# Altium project 2021_PCB_Project_PowerBoard.PrjPcb
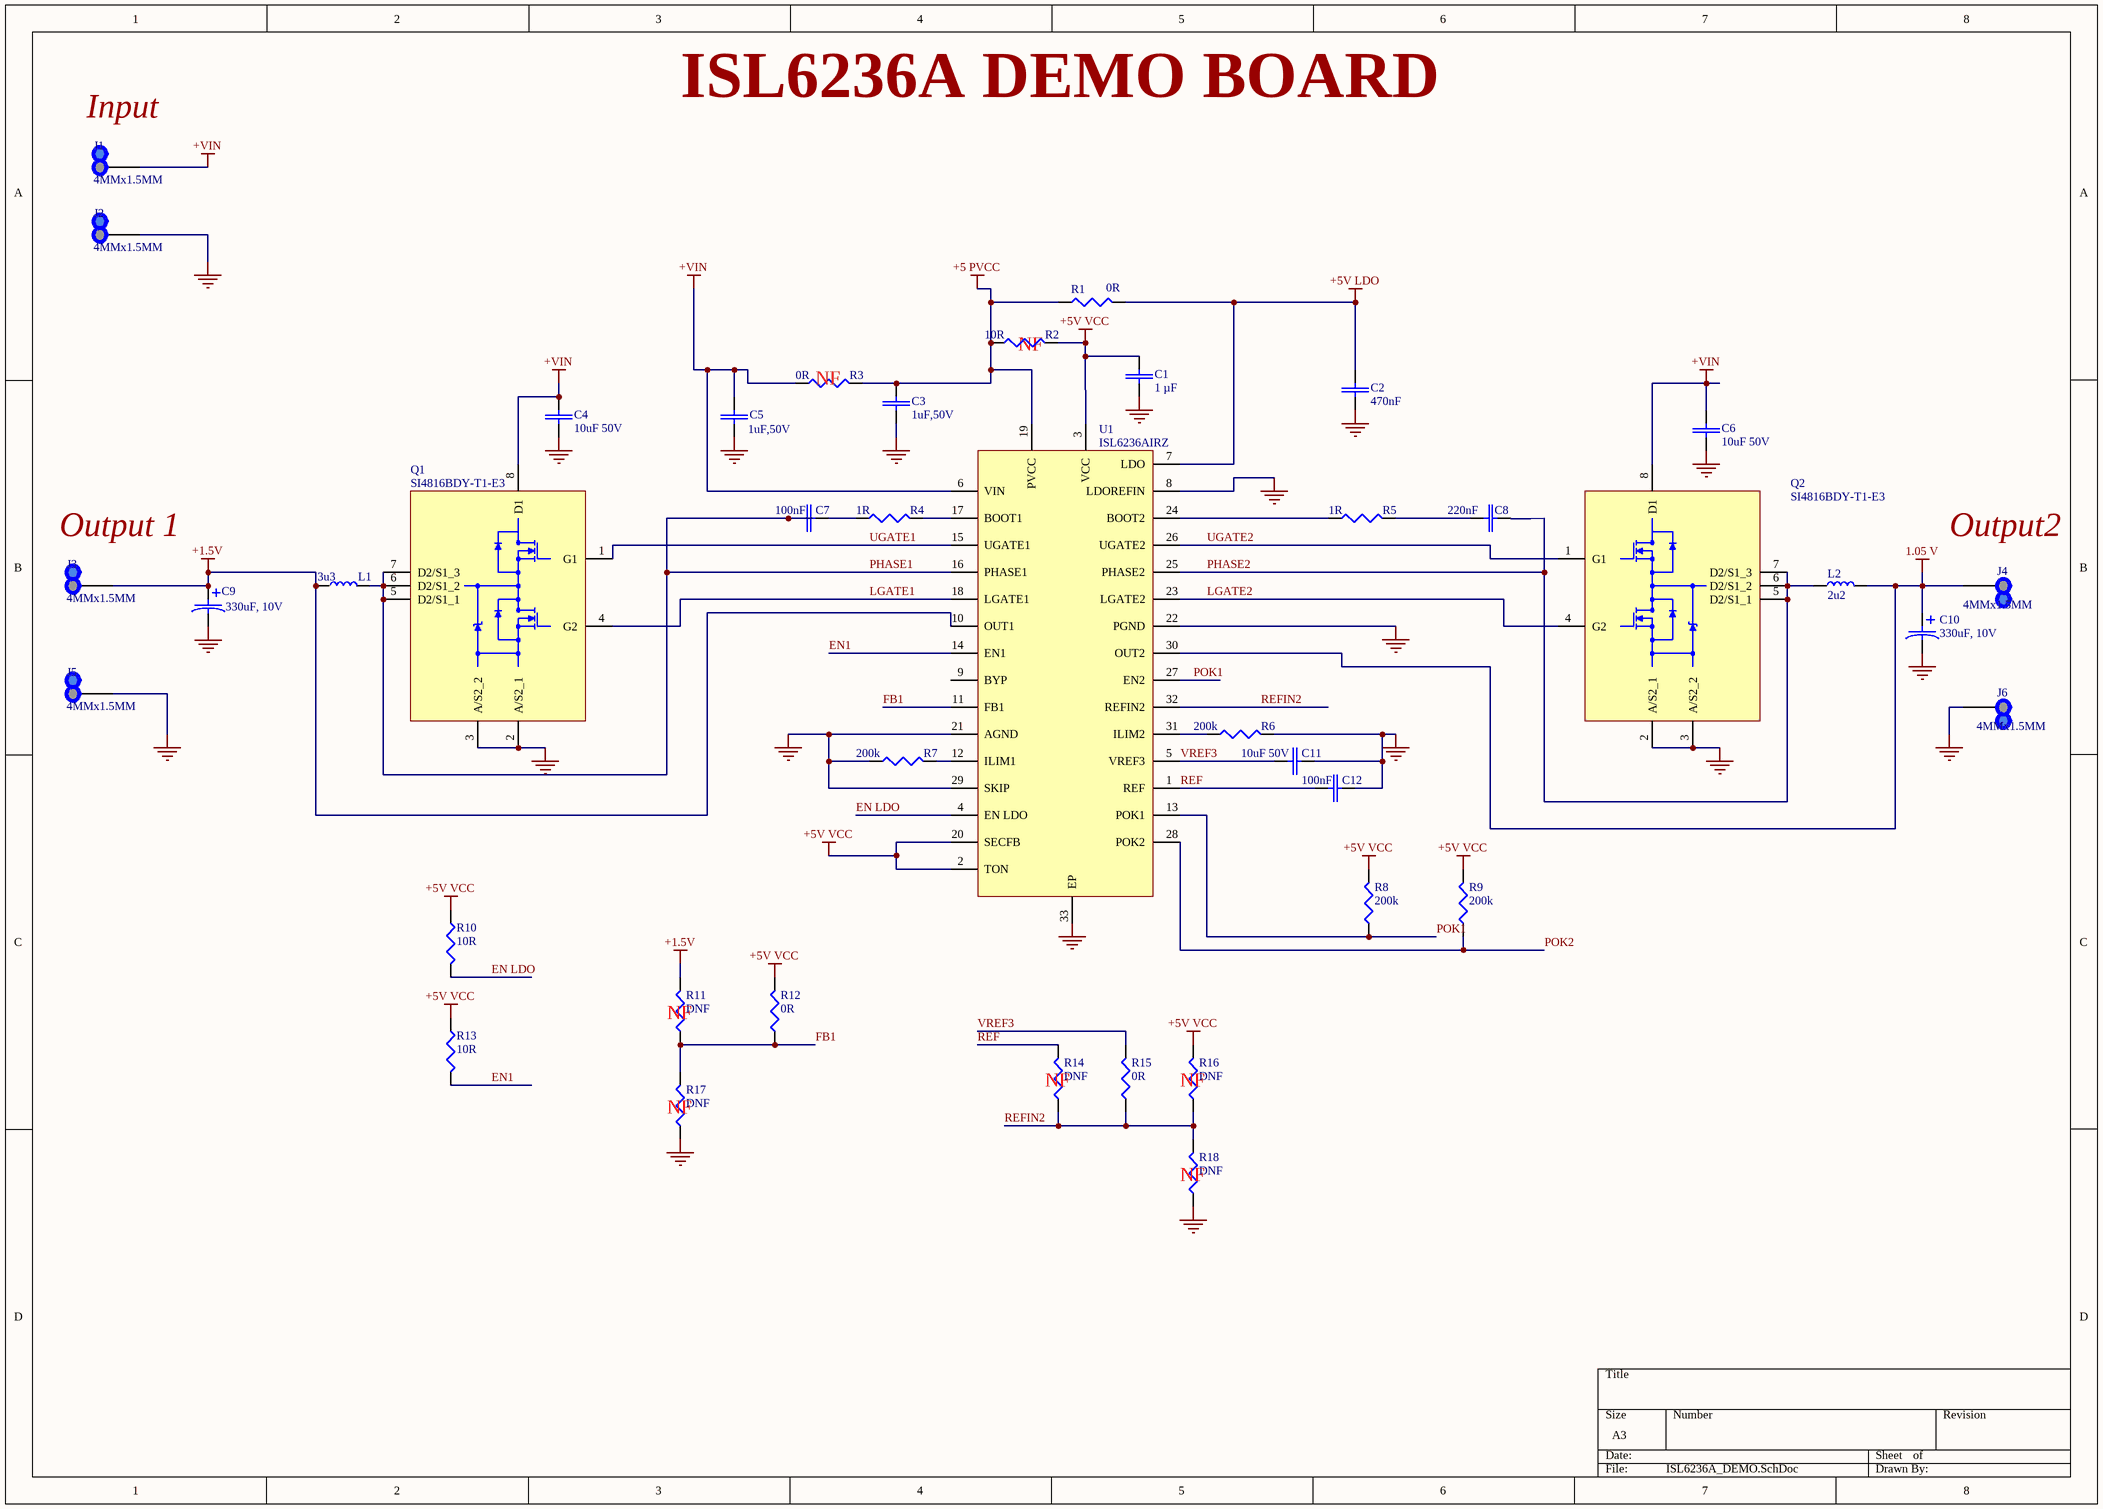
[diagram p0: ISL6236A_DEMO.SchDoc]
1 sheet, 41 parts. Net scope: global (net labels, ports and power ports of the same name join across sheets).
Board file: ISL6236A_DEMO.PcbDoc

## Sheet ISL6236A_DEMO.SchDoc: Schematic
size A3; Author: Ana Povea; DocumentNumber: 1

### Parts
C1  1 µF  [C0805]
C2  470nF  [C1206]
C3  1uF,50V  [C0805]
C4  10uF 50V  [C1210]
C5  1uF,50V  [C0805]
C6  10uF 50V  [C1210]
C7  100nF  [C0805]
C8  220nF  [C0805]
C9  330uF, 10V  [C7343-43]
C10  330uF, 10V  [C7343-43]
C11  10uF 50V  [C1210]
C12  100nF  [C0805]
J1  4MMx1.5MM  [PAD_WITH_HOLE_4MM_1.5MM]
J2  4MMx1.5MM  [PAD_WITH_HOLE_4MM_1.5MM]
J3  4MMx1.5MM  [PAD_WITH_HOLE_4MM_1.5MM]
J4  4MMx1.5MM  [PAD_WITH_HOLE_4MM_1.5MM]
J5  4MMx1.5MM  [PAD_WITH_HOLE_4MM_1.5MM]
J6  4MMx1.5MM  [PAD_WITH_HOLE_4MM_1.5MM]
L1  3u3  [Inductor 744313330]
L2  2u2  [Inductor PCC-M1040M-LP]
Q1  SI4816BDY-T1-E3  [SO-8]
Q2  SI4816BDY-T1-E3  [SO-8]
R1  0R  [R0805]
R2  10R  [R0805]
R3  0R  [R0805]
R4  1R  [C0805]
R5  1R  [C0805]
R6  200k  [R0805]
R7  200k  [R0805]
R8  200k  [R0805]
R9  200k  [R0805]
R10  10R  [R0805]
R11  DNF  [R0805]
R12  0R  [R0805]
R13  10R  [R0805]
R14  DNF  [R0805]
R15  0R  [R0805]
R16  DNF  [R0805]
R17  DNF  [R0805]
R18  DNF  [R0805]
U1  ISL6236AIRZ  [ISL5236A L32.5X5B - duplicate]

### Nets
1.05 V: C10.1 J4.1 L2.2 U1.30(OUT2)
+1.5V: C9.1 J3.1 L1.1 R11.2 U1.10(OUT1)
+5 PVCC: C3.2 R1.1 R2.1 R3.2 U1.19(PVCC)
+5V LDO: C2.2 R1.2 U1.7(LDO)
+5V VCC: C1.2 R2.2 R8.2 R9.2 R10.1 R12.2 R13.1 R16.2 U1.2(TON) U1.3(VCC) U1.20(SECFB)
+VIN: C4.2 C5.2 C6.2 J1.1 Q1.8(D1) Q2.8(D1) R3.1 U1.6(VIN)
GND: C1.1 C2.1 C3.1 C4.1 C5.1 C6.1 C9.2 C10.2 C11.2 C12.2 J2.1 J5.1 J6.1 Q1.2(A/S2_1) Q1.3(A/S2_2) Q2.2(A/S2_1) Q2.3(A/S2_2) R6.2 R7.1 R17.1 R18.1 U1.8(LDOREFIN) U1.21(AGND) U1.22(PGND) U1.29(SKIP) U1.33(EP)
EN1: R13.2 U1.14(EN1)
EN LDO: R10.2 U1.4(EN_LDO)
FB1: R11.1 R12.1 R17.2 U1.11(FB1)
LGATE1: Q1.4(G2) U1.18(LGATE1)
LGATE2: Q2.4(G2) U1.23(LGATE2)
PHASE1: C7.1 L1.2 Q1.5(D2/S1_1) Q1.6(D2/S1_2) Q1.7(D2/S1_3) U1.16(PHASE1)
PHASE2: C8.2 L2.1 Q2.5(D2/S1_1) Q2.6(D2/S1_2) Q2.7(D2/S1_3) U1.25(PHASE2)
POK1: R8.1 U1.13(POK1) U1.27(EN2)
POK2: R9.1 U1.28(POK2)
REF: C12.1 R14.2 U1.1(REF)
REFIN2: R14.1 R15.1 R16.1 R18.2 U1.32(REFIN2)
UGATE1: Q1.1(G1) U1.15(UGATE1)
UGATE2: Q2.1(G1) U1.26(UGATE2)
VREF3: C11.1 R15.2 U1.5(VREF3)
NetC7_2: C7.2 R4.1
NetC8_1: C8.1 R5.2
NetR4_2: R4.2 U1.17(BOOT1)
NetR5_1: R5.1 U1.24(BOOT2)
NetR6_1: R6.1 U1.31(ILIM2)
NetR7_2: R7.2 U1.12(ILIM1)

Not connected (* = marked no-connect by the designer): U1 9(BYP)

### Notes on the sheet
- ISL6236A DEMO BOARD
- (near J1) Input
- (near R2) NF
- (near R3) NF
- Output 1
- (near J4) Output2
- (near R11) NF
- (near R17) NF
- (near R14) NF
- (near R16) NF
- (near R18) NF

### Library data of the parts
C1 = 08053D105KAT2A: AVX - 08053D105KAT2A - Condensatore Ceramico Multistrato SMD, 1 µF, 25 V, 0805 [2012 Metrico], ± 10%, X5R; Manufacturer: Kyocera AVX; Capacitance: 1uF; Voltage Rating (DC): 25V; Supplier 1: Mouser; Supplier Part Number 1: 581-08053D105K; RoHS: Yes; Category: Ceramic Capacitors; Stock 1: 6380; Pricing 1: 1=0.52000, 10=0.27900, 50=0.27900, 100=0.22100, 1000=0.15200, 10000=0.10300 (USD); Mount: Surface Mount,PCB; Case/Package: 0805; Number of Pins: 2; Case Code (Metric): 2012; Case Code (Imperial): 0805; Contact Plating: Tin,Matte; Min Operating Temperature: -55°C; Max Operating Temperature: 85°C; Tolerance: 10%; Packaging: Tape and Reel; Dielectric: X5R; Voltage: 25V; Package Quantity: 3000; Voltage Rating: 25V; Termination: SMD/SMT; Series: -; Construction: Flat; Length: 2.01mm; Width: 0.049inch; Height: 1.4mm; Depth: 1.25mm; Thickness: 0.055inch; Radiation Hardening: No; REACH SVHC: No SVHC; Lead Free: Lead Free; RoHS Compliant: Yes; ComponentLink1URL: https://datasheet.ciiva.com/11786/0900766b80def1a5-11786776.pdf?src-supplier=RSComponents; ComponentLink1Description: https://datasheet.ciiva.com/11786/0900766b80def1a5-11786776.pdf?src-supplier=RSComponents; ComponentLink2URL: https://datasheet.ciiva.com/153/cx5r-153219.pdf?src-supplier=Digi-Key; ComponentLink2Description: https://datasheet.ciiva.com/153/cx5r-153219.pdf?src-supplier=Digi-Key; ComponentLink3URL: https://datasheet.ciiva.com/153/cx5r-153220.pdf?src-supplier=Digi-Key; ComponentLink3Description: https://datasheet.ciiva.com/153/cx5r-153220.pdf?src-supplier=Digi-Key; ComponentLink4URL: https://datasheet.ciiva.com/153/cx5r-153221.pdf?src-supplier=Digi-Key; ComponentLink4Description: https://datasheet.ciiva.com/153/cx5r-153221.pdf?src-supplier=Digi-Key; ComponentLink5URL: https://datasheet.ciiva.com/7255/1796776-7255029.pdf?src-supplier=Newark; ComponentLink5Description: https://datasheet.ciiva.com/7255/1796776-7255029.pdf?src-supplier=Newark; ComponentLink6URL: https://datasheet.ciiva.com/14600/70001028-14600197.pdf?src-supplier=Allied+Electronics; ComponentLink6Description: https://datasheet.ciiva.com/14600/70001028-14600197.pdf?src-supplier=Allied+Electronics; ComponentLink7URL: https://datasheet.ciiva.com/15165/getdatasheetpartid-50524-15165237.pdf?src-supplier=Verical; ComponentLink7Description: https://datasheet.ciiva.com/15165/getdatasheetpartid-50524-15165237.pdf?src-supplier=Verical; ComponentLink8URL: https://datasheet.ciiva.com/14586/70001028-14586727.pdf?src-supplier=Allied+Electronics; ComponentLink8Description: https://datasheet.ciiva.com/14586/70001028-14586727.pdf?src-supplier=Allied+Electronics; ComponentLink9URL: https://datasheet.ciiva.com/16537/cx5r-16537015.pdf?src-supplier=Avnet+Asia; ComponentLink9Description: https://datasheet.ciiva.com/16537/cx5r-16537015.pdf?src-supplier=Avnet+Asia; ComponentLink10URL: https://datasheet.ciiva.com/7812/1666675-7812010.pdf?src-supplier=Element14; ComponentLink10Description: https://datasheet.ciiva.com/7812/1666675-7812010.pdf?src-supplier=Element14; ComponentLink11URL: https://datasheet.ciiva.com/7812/84508-7812011.pdf?src-supplier=Element14; ComponentLink11Description: https://datasheet.ciiva.com/7812/84508-7812011.pdf?src-supplier=Element14; ComponentLink12URL: https://datasheet.ciiva.com/2987/cx5r-2987964.pdf?src-supplier=Avnet; ComponentLink12Description: https://datasheet.ciiva.com/2987/cx5r-2987964.pdf?src-supplier=Avnet; ComponentLink13URL: https://datasheet.ciiva.com/7812/84508-7812012.pdf?src-supplier=Element14; ComponentLink13Description: https://datasheet.ciiva.com/7812/84508-7812012.pdf?src-supplier=Element14; ComponentLink14URL: https://datasheet.ciiva.com/11499/cx5r-11499853.pdf?src-supplier=Avnet; ComponentLink14Description: https://datasheet.ciiva.com/11499/cx5r-11499853.pdf?src-supplier=Avnet; ComponentLink15URL: https://datasheet.ciiva.com/28586/759405-28586814.pdf?src-supplier=Element14; ComponentLink15Description: https://datasheet.ciiva.com/28586/759405-28586814.pdf?src-supplier=Element14; Manufacturer Part Number: 08053D105KAT2A
C2 = LMK316BJ475KD-T: Cap Ceramic 4.7uF 10V X5R 10% SMD 1206 85C T/R; Manufacturer: Taiyo Yuden; Supplier 1: Digi-Key; Supplier Part Number 1: 587-1340-1-ND; RoHS: Yes; Category: Ceramic Capacitors; Stock 1: 29799; Pricing 1: 1=0.35000, 10=0.24000, 50=0.16000, 100=0.13610, 500=0.09604, 1000=0.08404 (USD); Mount: Surface Mount; Case/Package: 1206; Number of Pins: 2; Case Code (Metric): 3216; Case Code (Imperial): 1206; Min Operating Temperature: -55°C; Max Operating Temperature: 85°C; Capacitance: 4.7uF; Tolerance: 10%; Packaging: Tape and Reel; Voltage Rating (DC): 10V; Dielectric: X5R; Package Quantity: 1; Voltage Rating: 10V; Termination: SMD/SMT; Resistor Type: Ceramic; Series: M; Construction: Flat; Length: 3.2mm; Width: 0.063inch; Height: 0.85mm; Thickness: 0.037inch; Depth: 1.6mm; Radiation Hardening: No; Lead Free: Lead Free; Halogen Free: Halogen Free; REACH SVHC: No SVHC; RoHS Compliant: Yes; ComponentLink1URL: https://datasheet.ciiva.com/137/lmk316bj475kd-t-ss-137640.pdf?src-supplier=Digi-Key; ComponentLink1Description: https://datasheet.ciiva.com/137/lmk316bj475kd-t-ss-137640.pdf?src-supplier=Digi-Key; ComponentLink2URL: https://datasheet.ciiva.com/26919/getdatasheetpartid-638474-26919229.pdf?src-supplier=Verical; ComponentLink2Description: https://datasheet.ciiva.com/26919/getdatasheetpartid-638474-26919229.pdf?src-supplier=Verical; ComponentLink3URL: https://datasheet.ciiva.com/30226/498lmk316bj475kd-t-30226925.pdf?src-supplier=Onlinecomponents.com; ComponentLink3Description: https://datasheet.ciiva.com/30226/498lmk316bj475kd-t-30226925.pdf?src-supplier=Onlinecomponents.com; ComponentLink4URL: https://datasheet.ciiva.com/7975/1481447-7975789.pdf?src-supplier=Element14; ComponentLink4Description: https://datasheet.ciiva.com/7975/1481447-7975789.pdf?src-supplier=Element14; ComponentLink5URL: https://datasheet.ciiva.com/11596/mlcc-all-e-11596885.pdf?src-supplier=Avnet; ComponentLink5Description: https://datasheet.ciiva.com/11596/mlcc-all-e-11596885.pdf?src-supplier=Avnet; Manufacturer Part Number: LMK316BJ475KD-T
C3 C5 = C2012X7R1H105K125AB: TDK - C2012X7R1H105K125AB - SMD Multilayer Ceramic Capacitor, 1 µF, 50 V, 0805 [2012 Metric], ± 10%, X7R, C Series TDK; Supplier 1: Digi-Key; Supplier Part Number 1: 445-7547-1-ND; RoHS: Yes; Category: Ceramic Capacitors; Stock 1: 15992; Pricing 1: 1=0.31000, 10=0.21500, 50=0.14360, 100=0.12200, 500=0.08612, 1000=0.07535 (USD); Mount: Surface Mount; Case/Package: 0805; Number of Pins: 2; Case Code (Metric): 2012; Case Code (Imperial): 0805; Weight: 0.000194oz; Dielectric Material: Ceramic; Min Operating Temperature: -55°C; Max Operating Temperature: 125°C; Packaging: Tape and Reel; Package Quantity: 1; Capacitance: 1uF; Tolerance: 10%; Voltage Rating: 50V; Voltage Rating (DC): 50V; Dielectric: X7R; Termination: SMD/SMT; Resistor Type: Ceramic; Series: C; Construction: Flat; Length: 2mm; Width: 0.049inch; Height: 1.25mm; Thickness: 0.057inch; Depth: 1.25mm; Radiation Hardening: No; REACH SVHC: No SVHC; Lead Free: Lead Free; RoHS Compliant: Yes; ComponentLink1URL: https://datasheet.ciiva.com/22718/1796654-22718037.pdf?src-supplier=Element14; ComponentLink1Description: https://datasheet.ciiva.com/22718/1796654-22718037.pdf?src-supplier=Element14; ComponentLink2URL: https://datasheet.ciiva.com/6274/tdkmlcccaprange-6274890.pdf?src-supplier=Digi-Key; ComponentLink2Description: https://datasheet.ciiva.com/6274/tdkmlcccaprange-6274890.pdf?src-supplier=Digi-Key; ComponentLink3URL: https://datasheet.ciiva.com/23803/1796654-23803036.pdf?src-supplier=Newark; ComponentLink3Description: https://datasheet.ciiva.com/23803/1796654-23803036.pdf?src-supplier=Newark; ComponentLink4URL: https://datasheet.ciiva.com/28673/mlcc-commercial-general-en-28673565.pdf?src-supplier=Element14; ComponentLink4Description: https://datasheet.ciiva.com/28673/mlcc-commercial-general-en-28673565.pdf?src-supplier=Element14; ComponentLink5URL: https://datasheet.ciiva.com/6274/tdkmlcccaprange-6274886.pdf?src-supplier=Digi-Key; ComponentLink5Description: https://datasheet.ciiva.com/6274/tdkmlcccaprange-6274886.pdf?src-supplier=Digi-Key; ComponentLink6URL: https://datasheet.ciiva.com/6274/tdkmlcccaprange-6274888.pdf?src-supplier=Digi-Key; ComponentLink6Description: https://datasheet.ciiva.com/6274/tdkmlcccaprange-6274888.pdf?src-supplier=Digi-Key; ComponentLink7URL: https://datasheet.ciiva.com/24191/general-b11-24191449.pdf?src-supplier=Future+Electronics; ComponentLink7Description: https://datasheet.ciiva.com/24191/general-b11-24191449.pdf?src-supplier=Future+Electronics; Manufacturer: TDK; Manufacturer Part Number: C2012X7R1H105K125AB
C4 C6 C11 = UMK325BJ106MMHP: CAP CER 10UF 50V X5R 1210; Manufacturer: Taiyo Yuden; Tolerance: 20%; Supplier 1: Digi-Key; Supplier Part Number 1: 587-6033-1-ND; RoHS: Yes; Category: Ceramic Capacitors; Stock 1: 9869; Pricing 1: 1=0.59000, 10=0.42000, 50=0.31760, 100=0.27670, 500=0.20492 (USD); Mount: Surface Mount; Case/Package: 1210; Case Code (Imperial): 1210; Case Code (Metric): 3225; Min Operating Temperature: -55°C; Max Operating Temperature: 85°C; Packaging: Cut Tape; Capacitance: 10uF; Voltage Rating: 50V; Ratings: AEC-Q200; RoHS Compliant: No; ComponentLink1URL: http://ds.yuden.co.jp/TYCOMPAS/ut/detail.do?productNo=UMK325BJ106MMHP&fileName=UMK325BJ106MMHP_SS&mode=specSheetDownload&src-supplier=Digi-Key; ComponentLink1Description: http://ds.yuden.co.jp/TYCOMPAS/ut/detail.do?productNo=UMK325BJ106MMHP&fileName=UMK325BJ106MMHP_SS&mode=specSheetDownload&src-supplier=Digi-Key; ComponentLink2URL: http://ds.yuden.co.jp/TYCOMPAS/ut/detail.do?productNo=UMK325BJ106MMHP&amp;fileName=UMK325BJ106MMHP_SS&amp;mode=specSheetDownload&src-supplier=Digi-Key; ComponentLink2Description: http://ds.yuden.co.jp/TYCOMPAS/ut/detail.do?productNo=UMK325BJ106MMHP&amp;fileName=UMK325BJ106MMHP_SS&amp;mode=specSheetDownload&src-supplier=Digi-Key; Manufacturer Part Number: UMK325BJ106MMHP
C7 C12 = 08055C104KAT4A: AVX - 08055C104KAT4A - Multilayer Ceramic Capacitor, 0.1 F, 10%, X7R, 50 V, 0805 [2012 Metric] RoHS Compliant: Yes; Manufacturer: Kyocera AVX; Voltage Rating (DC): 50V; Dissipation Factor: 2.5%; Supplier 1: Digi-Key; Supplier Part Number 1: 478-10836-6-ND; RoHS: Yes; Category: Ceramic Capacitors; Stock 1: 4587949; Pricing 1: 1=0.10000, 10=0.07600, 50=0.04140, 100=0.03380, 500=0.02416, 1000=0.01898, 2500=0.01725, 5000=0.01587 (USD); Mount: Surface Mount; Case/Package: 0805; Number of Pins: 2; Case Code (Imperial): 0805; Case Code (Metric): 2012; Dielectric Material: Ceramic; Min Operating Temperature: -55°C; Max Operating Temperature: 125°C; Capacitance: 100nF; Tolerance: 10%; Packaging: Tape and Reel; Voltage Rating: 50V; Package Quantity: 15000; Dielectric: X7R; Termination: SMD/SMT; Voltage: 50V; Construction: Flat; Length: 2.01mm; Width: 1.25mm; Height: 0.94mm; Depth: 1.25mm; Radiation Hardening: No; REACH SVHC: No SVHC; Lead Free: Lead Free; RoHS Compliant: Yes; ComponentLink1URL: https://datasheet.ciiva.com/2988/cx7r-2988016.pdf?src-supplier=Avnet; ComponentLink1Description: https://datasheet.ciiva.com/2988/cx7r-2988016.pdf?src-supplier=Avnet; ComponentLink2URL: https://datasheet.ciiva.com/28613/1679506-28613114.pdf?src-supplier=Element14; ComponentLink2Description: https://datasheet.ciiva.com/28613/1679506-28613114.pdf?src-supplier=Element14; ComponentLink3URL: https://datasheet.ciiva.com/5423/cx7r-218113-5423437.pdf?src-supplier=Mouser; ComponentLink3Description: https://datasheet.ciiva.com/5423/cx7r-218113-5423437.pdf?src-supplier=Mouser; ComponentLink4URL: https://datasheet.ciiva.com/16222/cx7r-16222253.pdf?src-supplier=Future+Electronics; ComponentLink4Description: https://datasheet.ciiva.com/16222/cx7r-16222253.pdf?src-supplier=Future+Electronics; ComponentLink5URL: https://datasheet.ciiva.com/22676/1679506-22676605.pdf?src-supplier=Element14; ComponentLink5Description: https://datasheet.ciiva.com/22676/1679506-22676605.pdf?src-supplier=Element14; ComponentLink6URL: https://datasheet.ciiva.com/2988/cx7r-2988015.pdf?src-supplier=Avnet; ComponentLink6Description: https://datasheet.ciiva.com/2988/cx7r-2988015.pdf?src-supplier=Avnet; Manufacturer Part Number: 08055C104KAT4A
C8 = UMK212B7224KG-T: TAIYO YUDEN - UMK212B7224KG-T - CERAMIC CAPACITOR 0.22UF, 50V, X7R, 10%, 0805, FULL REEL; Supplier 1: Digi-Key; Supplier Part Number 1: 587-1287-1-ND; RoHS: Yes; Category: Ceramic Capacitors; Stock 1: 141709; Pricing 1: 1=0.15000, 10=0.10600, 50=0.06040, 100=0.05000, 500=0.03508, 1000=0.02904 (USD); Mount: Surface Mount; Case/Package: 0805; Case Code (Metric): 2012; Case Code (Imperial): 0805; Contact Plating: Nickel; Min Operating Temperature: -55°C; Max Operating Temperature: 125°C; Capacitance: 220nF; Tolerance: 10%; Packaging: Tape and Reel; Voltage Rating (DC): 50V; Dielectric: X7R; Voltage Rating: 50V; Package Quantity: 1; Termination: SMD/SMT; Voltage: 50V; Series: M; Construction: Flat; Length: 2mm; Width: 0.049inch; Height: 1.25mm; Thickness: 0.053inch; Depth: 1.25mm; Radiation Hardening: No; Halogen Free: Halogen Free; REACH SVHC: Unknown; RoHS Compliant: Yes; ComponentLink1URL: https://datasheet.ciiva.com/133/umk212b7224kg-t-ss-133747.pdf?src-supplier=Digi-Key; ComponentLink1Description: https://datasheet.ciiva.com/133/umk212b7224kg-t-ss-133747.pdf?src-supplier=Digi-Key; ComponentLink2URL: https://datasheet.ciiva.com/15922/1134umk212b7224kg-t-15922643.pdf?src-supplier=Onlinecomponents.com; ComponentLink2Description: https://datasheet.ciiva.com/15922/1134umk212b7224kg-t-15922643.pdf?src-supplier=Onlinecomponents.com; ComponentLink3URL: https://datasheet.ciiva.com/30106/209umk212b7224kg-t-30106923.pdf?src-supplier=Onlinecomponents.com; ComponentLink3Description: https://datasheet.ciiva.com/30106/209umk212b7224kg-t-30106923.pdf?src-supplier=Onlinecomponents.com; ComponentLink4URL: https://datasheet.ciiva.com/30164/55umk212b7224kg-t-30164219.pdf?src-supplier=Onlinecomponents.com; ComponentLink4Description: https://datasheet.ciiva.com/30164/55umk212b7224kg-t-30164219.pdf?src-supplier=Onlinecomponents.com; ComponentLink5URL: https://datasheet.ciiva.com/15165/getdatasheetpartid-63436-15165368.pdf?src-supplier=Verical; ComponentLink5Description: https://datasheet.ciiva.com/15165/getdatasheetpartid-63436-15165368.pdf?src-supplier=Verical; ComponentLink6URL: https://datasheet.ciiva.com/28645/746258-28645309.pdf?src-supplier=Element14; ComponentLink6Description: https://datasheet.ciiva.com/28645/746258-28645309.pdf?src-supplier=Element14; Manufacturer: Taiyo Yuden; Manufacturer Part Number: UMK212B7224KG-T
C9 C10 = T530X337M010ATE004: Tantalum Capacitors - Polymer SMD 330uF 10volts 20%; Manufacturer: KEMET; Ripple Current: 8.2A; ESR (Equivalent Series Resistance): 4mR; Leakage Current: 330uA; Polarity: Polar; Dissipation Factor: 8%; Life (Hours): 2000Hour; Supplier 1: Farnell; Supplier Part Number 1: 2442694; RoHS: Yes; Category: Polymer Capacitors; Stock 1: 1; Pricing 1: 1=7.94000, 10=5.39000, 50=4.71000, 100=4.31000, 200=4.23000 (EUR); Mount: Surface Mount,PCB; Case/Package: 2917; Case Code (Imperial): 2917; Case Code (Metric): 7343; Min Operating Temperature: -55°C; Max Operating Temperature: 125°C; Package Quantity: 500; Voltage Rating (DC): 10V; Capacitance: 330uF; Tolerance: 20%; Packaging: Tape and Reel; Voltage Rating: 10V; Termination: SMD/SMT; Voltage: 10V; Features: General Purpose; Series: T530; Construction: Flat; Length: 7.3mm; Width: 4.3mm; Height: 4mm; Height - Seated (Max): 0.169inch; Depth: 4.3mm; REACH SVHC: No SVHC; RoHS Compliant: Yes; ComponentLink1URL: https://datasheet.ciiva.com/11794/0900766b80deaa91-11794477.pdf?src-supplier=RSComponents; ComponentLink1Description: https://datasheet.ciiva.com/11794/0900766b80deaa91-11794477.pdf?src-supplier=RSComponents; ComponentLink2URL: https://datasheet.ciiva.com/14593/70096008-14593753.pdf?src-supplier=Allied+Electronics; ComponentLink2Description: https://datasheet.ciiva.com/14593/70096008-14593753.pdf?src-supplier=Allied+Electronics; Manufacturer Part Number: T530X337M010ATE004
J1-J6 = PAD_WITH_HOLE_4MMx1.5MM: Pad with a hole 4mm x 1.5mm
L1 = 744313330: WURTH ELEKTRONIK - 744313330 - INDUCTOR, HIGH CURRENT 2.45UH, SMD; Manufacturer: Wurth Electronics; Self Resonant Frequency: 30MHz; Inductance Tolerance: 20%; Shielding: Shielded; Current Rating: 12A; Saturation Current: 14A; Inductance: 3.3uH; DC Resistance (DCR): 8.1mR; Test Frequency: 100kHz; Supplier 1: Digi-Key; Supplier Part Number 1: 732-3868-1-ND; RoHS: Yes; Category: Fixed Inductors; Stock 1: 257; Pricing 1: 1=4.01000, 10=3.93100, 50=3.62900, 100=3.47800, 200=3.25100 (USD); Mount: Surface Mount; Case/Package: Nonstandard; Number of Pins: 2; Min Operating Temperature: -40°C; Max Operating Temperature: 150°C; Packaging: Tape and Reel; Tolerance: 20%; Package Quantity: 1; Max DC Current: 12A; Termination: SMD/SMT; Resistor Type: Wirewound; RMS Current (Irms): 12A; Series: WE-HCI; Length: 0.504inch; Width: 12.8mm; Height: 3.3mm; Height - Seated (Max): 0.138inch; REACH SVHC: Unknown; Lead Free: Lead Free; RoHS Compliant: Yes; ComponentLink1URL: https://datasheet.ciiva.com/13320/744313330-77882-13320833.pdf?src-supplier=Mouser; ComponentLink1Description: https://datasheet.ciiva.com/13320/744313330-77882-13320833.pdf?src-supplier=Mouser; ComponentLink2URL: https://datasheet.ciiva.com/6693/744313330-6693493.pdf?src-supplier=Digi-Key; ComponentLink2Description: https://datasheet.ciiva.com/6693/744313330-6693493.pdf?src-supplier=Digi-Key; ComponentLink3URL: https://datasheet.ciiva.com/7765/1735753-7765018.pdf?src-supplier=Element14; ComponentLink3Description: https://datasheet.ciiva.com/7765/1735753-7765018.pdf?src-supplier=Element14; ComponentLink4URL: https://datasheet.ciiva.com/6693/744313330-6693495.pdf?src-supplier=Digi-Key; ComponentLink4Description: https://datasheet.ciiva.com/6693/744313330-6693495.pdf?src-supplier=Digi-Key; ComponentLink5URL: https://datasheet.ciiva.com/6693/744313330-6693496.pdf?src-supplier=Digi-Key; ComponentLink5Description: https://datasheet.ciiva.com/6693/744313330-6693496.pdf?src-supplier=Digi-Key; Manufacturer Part Number: 744313330
L2 = ETQP4M2R2KVC: Power Choke Shielded Wirewound 2.2uH 20% 100KHz Metal 14.8A 0.00748Ohm DCR Automotive T/R; Manufacturer: Panasonic; RMS Current (Irms): 12.1A; Saturation Current: 21A; DC Resistance (DCR): 7.48mR; Supplier 1: Digi-Key; Supplier Part Number 1: PCD2462CT-ND; RoHS: Yes; Category: Fixed Inductors; Stock 1: 71; Pricing 1: 1=1.16000, 10=1.07700, 25=0.99400, 50=0.82840, 100=0.77860, 250=0.69576 (USD); Mount: Surface Mount; Inductance: 2.2uH; Packaging: Cut Tape; Inductance Tolerance: 20%; REACH SVHC: Unknown; RoHS Compliant: Yes; ComponentLink1URL: https://media.digikey.com/pdf/Data%20Sheets/Panasonic%20Inductors%20Coils%20Filters%20PDFs/ETQ-P_Series_NPI.pdf?src-supplier=Digi-Key; ComponentLink1Description: https://media.digikey.com/pdf/Data%20Sheets/Panasonic%20Inductors%20Coils%20Filters%20PDFs/ETQ-P_Series_NPI.pdf?src-supplier=Digi-Key; ComponentLink2URL: http://www.farnell.com/datasheets/2144948.pdf?src-supplier=Element14; ComponentLink2Description: http://www.farnell.com/datasheets/2144948.pdf?src-supplier=Element14; Manufacturer Part Number: ETQP4M2R2KVC
Q1 Q2 = SI4816BDY-T1-E3: MOSFET 2N-CH 30V 5.8A 8-SOIC; Manufacturer: Vishay Siliconix; Nominal Vgs: 3V; Rise Time: 9ns; Rds On Max: 18.5mR; Number of Elements: 2; Continuous Drain Current (ID): 8.2A; Drain to Source Resistance: 11.5mR; Gate to Source Voltage (Vgs): 20V; Max Power Dissipation: 1.25W; Turn-Off Delay Time: 31ns; Turn-On Delay Time: 13ns; Threshold Voltage: 1V; Element Configuration: Single; FET Type: 2 N-Channel; Polarity: N-CHANNEL; Supplier 1: Digi-Key; Supplier Part Number 1: SI4816BDY-T1-E3CT-ND; RoHS: Yes; Category: MOSFETs; Stock 1: 74; Pricing 1: 1=1.72000, 10=1.54500, 25=1.45760, 100=1.24180, 500=1.02024, 1000=0.87450 (USD); Mount: Surface Mount; Case/Package: SO; Number of Pins: 8; Weight: 0.006596oz; Min Operating Temperature: -55°C; Max Operating Temperature: 150°C; Packaging: Tape and Reel; Package Quantity: 1; Drain to Source Voltage (Vdss): 30V; Fall Time: 9ns; Number of Channels: 2; On-State Resistance: 18.5mR; Series: LITTLE FOOT®; Drain-source On Resistance-Max: 18.5mR; Length: 5mm; Width: 4mm; Height: 1.55mm; Radiation Hardening: No; REACH SVHC: Unknown; Lead Free: Lead Free; RoHS Compliant: Yes; ComponentLink1URL: https://datasheet.ciiva.com/15137/getdatasheetpartid-99188-15137841.pdf?src-supplier=Verical; ComponentLink1Description: https://datasheet.ciiva.com/15137/getdatasheetpartid-99188-15137841.pdf?src-supplier=Verical; ComponentLink2URL: https://datasheet.ciiva.com/7710/si4816bd-7710449.pdf?src-supplier=Element14; ComponentLink2Description: https://datasheet.ciiva.com/7710/si4816bd-7710449.pdf?src-supplier=Element14; ComponentLink3URL: https://datasheet.ciiva.com/26789/si4816bdy-t1-e3-26789112.pdf?src-supplier=IIIC; ComponentLink3Description: https://datasheet.ciiva.com/26789/si4816bdy-t1-e3-26789112.pdf?src-supplier=IIIC; ComponentLink4URL: https://datasheet.ciiva.com/11161/si4816bd-11161496.pdf?src-supplier=Avnet; ComponentLink4Description: https://datasheet.ciiva.com/11161/si4816bd-11161496.pdf?src-supplier=Avnet; ComponentLink5URL: https://datasheet.ciiva.com/928/si4816bd-928460.pdf?src-supplier=Digi-Key; ComponentLink5Description: https://datasheet.ciiva.com/928/si4816bd-928460.pdf?src-supplier=Digi-Key; ComponentLink6URL: https://datasheet.ciiva.com/16486/si4816bd-16486349.pdf?src-supplier=Future+Electronics; ComponentLink6Description: https://datasheet.ciiva.com/16486/si4816bd-16486349.pdf?src-supplier=Future+Electronics; ComponentLink7URL: https://datasheet.ciiva.com/26136/si4816bd-26136990.pdf?src-supplier=Avnet+Europe; ComponentLink7Description: https://datasheet.ciiva.com/26136/si4816bd-26136990.pdf?src-supplier=Avnet+Europe; ComponentLink8URL: https://datasheet.ciiva.com/18448/70026226-18448822.pdf?src-supplier=Allied+Electronics; ComponentLink8Description: https://datasheet.ciiva.com/18448/70026226-18448822.pdf?src-supplier=Allied+Electronics; ComponentLink9URL: https://datasheet.ciiva.com/928/si4816bd-928458.pdf?src-supplier=Digi-Key; ComponentLink9Description: https://datasheet.ciiva.com/928/si4816bd-928458.pdf?src-supplier=Digi-Key; ComponentLink10URL: https://datasheet.ciiva.com/928/si4816bd-928459.pdf?src-supplier=Digi-Key; ComponentLink10Description: https://datasheet.ciiva.com/928/si4816bd-928459.pdf?src-supplier=Digi-Key; Manufacturer Part Number: SI4816BDY-T1-E3
R1 R3 R12 R15 = RMCF0805ZT0R00: STACKPOLE ELECTRONICS - RMCF0805ZT0R00. - RES THKFLM 0805 0 OHM JUMPER 1/8W 200PPM/ C SMD ROHS COMPLIANT: YES; Power Rating: 125mW; Supplier 1: Digi-Key; Supplier Part Number 1: RMCF0805ZT0R00CT-ND; RoHS: Yes; Category: Chip SMD Resistors; Stock 1: 2506883; Pricing 1: 1=0.10000, 10=0.01700, 25=0.01280, 50=0.00960, 100=0.00710, 250=0.00540, 500=0.00432, 1000=0.00318 (USD); Mount: Surface Mount; Case/Package: 0805; Case Code (Metric): 2012; Case Code (Imperial): 0805; Contact Plating: Tin,Matte; Size Code: 0805; Min Operating Temperature: -55°C; Max Operating Temperature: 155°C; Resistance: 0R; Packaging: Tape and Reel; Resistor Type: Thick Film; Number of Terminations: 2; Max Power Dissipation: 125mW; Features: Automotive AEC-Q200; Series: RMCF; Construction: Rectangular; Length: 2mm; Width: 0.049inch; Height: 0.026inch; Depth: 1.25mm; Radiation Hardening: No; Lead Free: Lead Free; Military Standard: Not; RoHS Compliant: Yes; ComponentLink1URL: https://datasheet.ciiva.com/15193/getdatasheetpartid-360417-15193658.pdf?src-supplier=Verical; ComponentLink1Description: https://datasheet.ciiva.com/15193/getdatasheetpartid-360417-15193658.pdf?src-supplier=Verical; Manufacturer: Stackpole Electronics; Manufacturer Part Number: RMCF0805ZT0R00
R2 R10 R13 = RNCF0805AKT10R0: Res Thin Film 0805 10 Ohm 0.05% 1/10W 10ppm/C Molded SMD SMD Paper T/R; Manufacturer: Stackpole Electronics; Max Power Dissipation: 125mW; Temperature Coefficient: 10ppm/°C; Supplier 1: Digi-Key; Supplier Part Number 1: RNCF0805AKT10R0CT-ND; RoHS: Yes; Category: Chip SMD Resistors; Stock 1: 8702; Pricing 1: 1=0.91000, 10=0.79200, 100=0.55200 (USD); Mount: Surface Mount; Case/Package: 0805; Case Code (Metric): 2012; Case Code (Imperial): 0805; Contact Plating: Tin,Matte; Min Operating Temperature: -55°C; Max Operating Temperature: 155°C; Package Quantity: 1000; Packaging: Tape and Reel; Resistance: 10R; Tolerance: 0.05%; Resistor Type: Thin Film; Number of Terminations: 2; Features: Moisture Resistant; Series: RNCF; Length: 0.079inch; Width: 0.049inch; Height: 0.026inch; Radiation Hardening: No; RoHS Compliant: Yes; ComponentLink1URL: https://www.seielect.com/catalog/sei-rncf.pdf?src-supplier=Digi-Key; ComponentLink1Description: https://www.seielect.com/catalog/sei-rncf.pdf?src-supplier=Digi-Key; ComponentLink2URL: https://www.seielect.com/Catalog/SEI-rncf.pdf?src-supplier=Avnet; ComponentLink2Description: https://www.seielect.com/Catalog/SEI-rncf.pdf?src-supplier=Avnet; Manufacturer Part Number: RNCF0805AKT10R0
R4 R5 = ERJ-6RQF1R0V: SISTOR, THICK FILM, 1 OHM, 125mW, 1%; Product Range:PANASONIC - ERJ Series; Resistance:1ohm; Power Rating:125mW; Resistance Tolerance:± 1%; Resistor Case Style:0805 ^2012 Metric]; Resistor Element Type:Thick Film; MSL:-; Temperature Coefficient: 200ppm/°C; Supplier 1: Digi-Key; Supplier Part Number 1: P1.0DCT-ND; RoHS: Yes; Category: Chip SMD Resistors; Stock 1: 27352; Pricing 1: 1=0.32000, 10=0.27000, 25=0.19600, 50=0.14200, 100=0.10540, 250=0.08084, 500=0.06370, 1000=0.04410 (USD); Mount: Surface Mount; Case/Package: 0805; Number of Pins: 2; Case Code (Imperial): 0805; Case Code (Metric): 2012; Contact Plating: Tin; Size Code: 0805; Min Operating Temperature: -55°C; Max Operating Temperature: 125°C; Packaging: Tape and Reel; Package Quantity: 5000; Series: ERJ; Resistance: 1R; Tolerance: 1%; Power Rating: 125mW; Termination: SMD/SMT; Resistor Type: Thick Film; Number of Terminations: 2; Max Power Dissipation: 125mW; Technology: THICK FILM; Resistance Tolerance: 1%; Construction: Rectangular; Length: 2mm; Width: 1.2mm; Height: 0.6mm; Depth: 1.25mm; Radiation Hardening: No; Lead Free: Lead Free; RoHS Compliant: Yes; REACH SVHC: No SVHC; Military Standard: Not; ComponentLink1URL: https://datasheet.ciiva.com/11818/0900766b80eefa12-11818468.pdf?src-supplier=RSComponents; ComponentLink1Description: https://datasheet.ciiva.com/11818/0900766b80eefa12-11818468.pdf?src-supplier=RSComponents; ComponentLink2URL: https://datasheet.ciiva.com/36525/1381829-36525978.pdf?src-supplier=Jameco; ComponentLink2Description: https://datasheet.ciiva.com/36525/1381829-36525978.pdf?src-supplier=Jameco; ComponentLink3URL: https://datasheet.ciiva.com/46446/391509-46446341.pdf?src-supplier=Element14; ComponentLink3Description: https://datasheet.ciiva.com/46446/391509-46446341.pdf?src-supplier=Element14; ComponentLink4URL: https://datasheet.ciiva.com/28691/391509-28691990.pdf?src-supplier=Element14; ComponentLink4Description: https://datasheet.ciiva.com/28691/391509-28691990.pdf?src-supplier=Element14; ComponentLink5URL: https://datasheet.ciiva.com/16783/70068852-16783991.pdf?src-supplier=Allied+Electronics; ComponentLink5Description: https://datasheet.ciiva.com/16783/70068852-16783991.pdf?src-supplier=Allied+Electronics; ComponentLink6URL: https://datasheet.ciiva.com/9198/aoa0000ce3-9198856.pdf?src-supplier=Avnet; ComponentLink6Description: https://datasheet.ciiva.com/9198/aoa0000ce3-9198856.pdf?src-supplier=Avnet; ComponentLink7URL: https://datasheet.ciiva.com/17215/aoa0000ce3-17215193.pdf?src-supplier=Avnet+Europe; ComponentLink7Description: https://datasheet.ciiva.com/17215/aoa0000ce3-17215193.pdf?src-supplier=Avnet+Europe; ComponentLink8URL: https://datasheet.ciiva.com/16507/aoa0000ce3-16507437.pdf?src-supplier=Future+Electronics; ComponentLink8Description: https://datasheet.ciiva.com/16507/aoa0000ce3-16507437.pdf?src-supplier=Future+Electronics; Manufacturer: Panasonic; Manufacturer Part Number: ERJ-6RQF1R0V
R6-R9 = ERJ-6ENF2003V: PANASONIC ELECTRONIC COMPONENTS         ERJ6ENF2003V            Surface Mount Chip Resistor, Thick Film, AEC-Q200 ERJ6E Series, 200 kohm, 125 mW,  1%, 150 V; Power Rating: 125mW; Voltage Rating: 150V; Resistance: 200kR; Temperature Coefficient: 100ppm/°C; Supplier 1: Digi-Key; Supplier Part Number 1: P200KCCT-ND; RoHS: Yes; Category: Chip SMD Resistors; Stock 1: 18321; Pricing 1: 1=0.10000, 10=0.07500, 100=0.02880, 1000=0.01265, 2500=0.01092 (USD); Mount: Surface Mount; Case/Package: 0805; Case Code (Imperial): 0805; Case Code (Metric): 2012; Contact Plating: Tin; Size Code: 0805; Min Operating Temperature: -55°C; Max Operating Temperature: 155°C; Tolerance: 1%; Packaging: Tape and Reel; Package Quantity: 1; Termination: SMD/SMT; Resistor Type: Thick Film; Number of Terminations: 2; Max Power Dissipation: 125mW; Voltage Rating (DC): 150V; Features: Automotive AEC-Q200; Series: ERJ; Technology: THICK FILM; Construction: Rectangular; Resistance Tolerance: 1%; Length: 2mm; Width: 1.2mm; Height: 0.6mm; Depth: 1.25mm; Radiation Hardening: No; REACH SVHC: No SVHC; Military Standard: Not; Lead Free: Lead Free; RoHS Compliant: Yes; ComponentLink1URL: https://datasheet.ciiva.com/3883/3984280s8821682n1386-3883650.pdf?src-supplier=Arrow+Electronics; ComponentLink1Description: https://datasheet.ciiva.com/3883/3984280s8821682n1386-3883650.pdf?src-supplier=Arrow+Electronics; ComponentLink2URL: https://datasheet.ciiva.com/11821/0900766b80f80784-11821569.pdf?src-supplier=RSComponents; ComponentLink2Description: https://datasheet.ciiva.com/11821/0900766b80f80784-11821569.pdf?src-supplier=RSComponents; ComponentLink3URL: https://datasheet.ciiva.com/24070/aoa0000ce2-24070837.pdf?src-supplier=Mouser; ComponentLink3Description: https://datasheet.ciiva.com/24070/aoa0000ce2-24070837.pdf?src-supplier=Mouser; ComponentLink4URL: https://datasheet.ciiva.com/30251/aoa0000ce2-30251689.pdf?src-supplier=Onlinecomponents.com; ComponentLink4Description: https://datasheet.ciiva.com/30251/aoa0000ce2-30251689.pdf?src-supplier=Onlinecomponents.com; ComponentLink5URL: https://datasheet.ciiva.com/5868/426256-5868186.pdf?src-supplier=Farnell; ComponentLink5Description: https://datasheet.ciiva.com/5868/426256-5868186.pdf?src-supplier=Farnell; ComponentLink6URL: https://datasheet.ciiva.com/28675/1678782-28675835.pdf?src-supplier=Element14; ComponentLink6Description: https://datasheet.ciiva.com/28675/1678782-28675835.pdf?src-supplier=Element14; ComponentLink7URL: https://datasheet.ciiva.com/16427/aoa0000ce2-16427100.pdf?src-supplier=Future+Electronics; ComponentLink7Description: https://datasheet.ciiva.com/16427/aoa0000ce2-16427100.pdf?src-supplier=Future+Electronics; ComponentLink8URL: https://datasheet.ciiva.com/28577/1678782-28577790.pdf?src-supplier=Element14; ComponentLink8Description: https://datasheet.ciiva.com/28577/1678782-28577790.pdf?src-supplier=Element14; ComponentLink9URL: https://datasheet.ciiva.com/46374/426256-46374223.pdf?src-supplier=Element14; ComponentLink9Description: https://datasheet.ciiva.com/46374/426256-46374223.pdf?src-supplier=Element14; Manufacturer: Panasonic; Manufacturer Part Number: ERJ-6ENF2003V
R11 R14 R16-R18 = RES
U1 = ISL6236AIRZ: IC MAIN PWR CTRLR QUAD 32-QFN; Manufacturer: Intersil; Number of Outputs: 4; Output Current: 20A; Switching Frequency: 500kHz; Supplier 1: Newark; Supplier Part Number 1: 52M5562; RoHS: Yes; Category: Voltage Regulators - Switching; Mount: Surface Mount; Case/Package: QFN; Min Operating Temperature: -40°C; Max Operating Temperature: 100°C; Packaging: Rail/Tube; Package Quantity: 60; Length: 5mm; Width: 5mm; Height: 0.95mm; Radiation Hardening: No; RoHS Compliant: Yes; Lead Free: Lead Free; ComponentLink1URL: https://datasheet.ciiva.com/25905/fn6453-25905351.pdf?src-supplier=Avnet+Europe; ComponentLink1Description: https://datasheet.ciiva.com/25905/fn6453-25905351.pdf?src-supplier=Avnet+Europe; Manufacturer Part Number: ISL6236AIRZ